# EAGLE design GE863FTDI_2.0 (EAGLE 5.07)
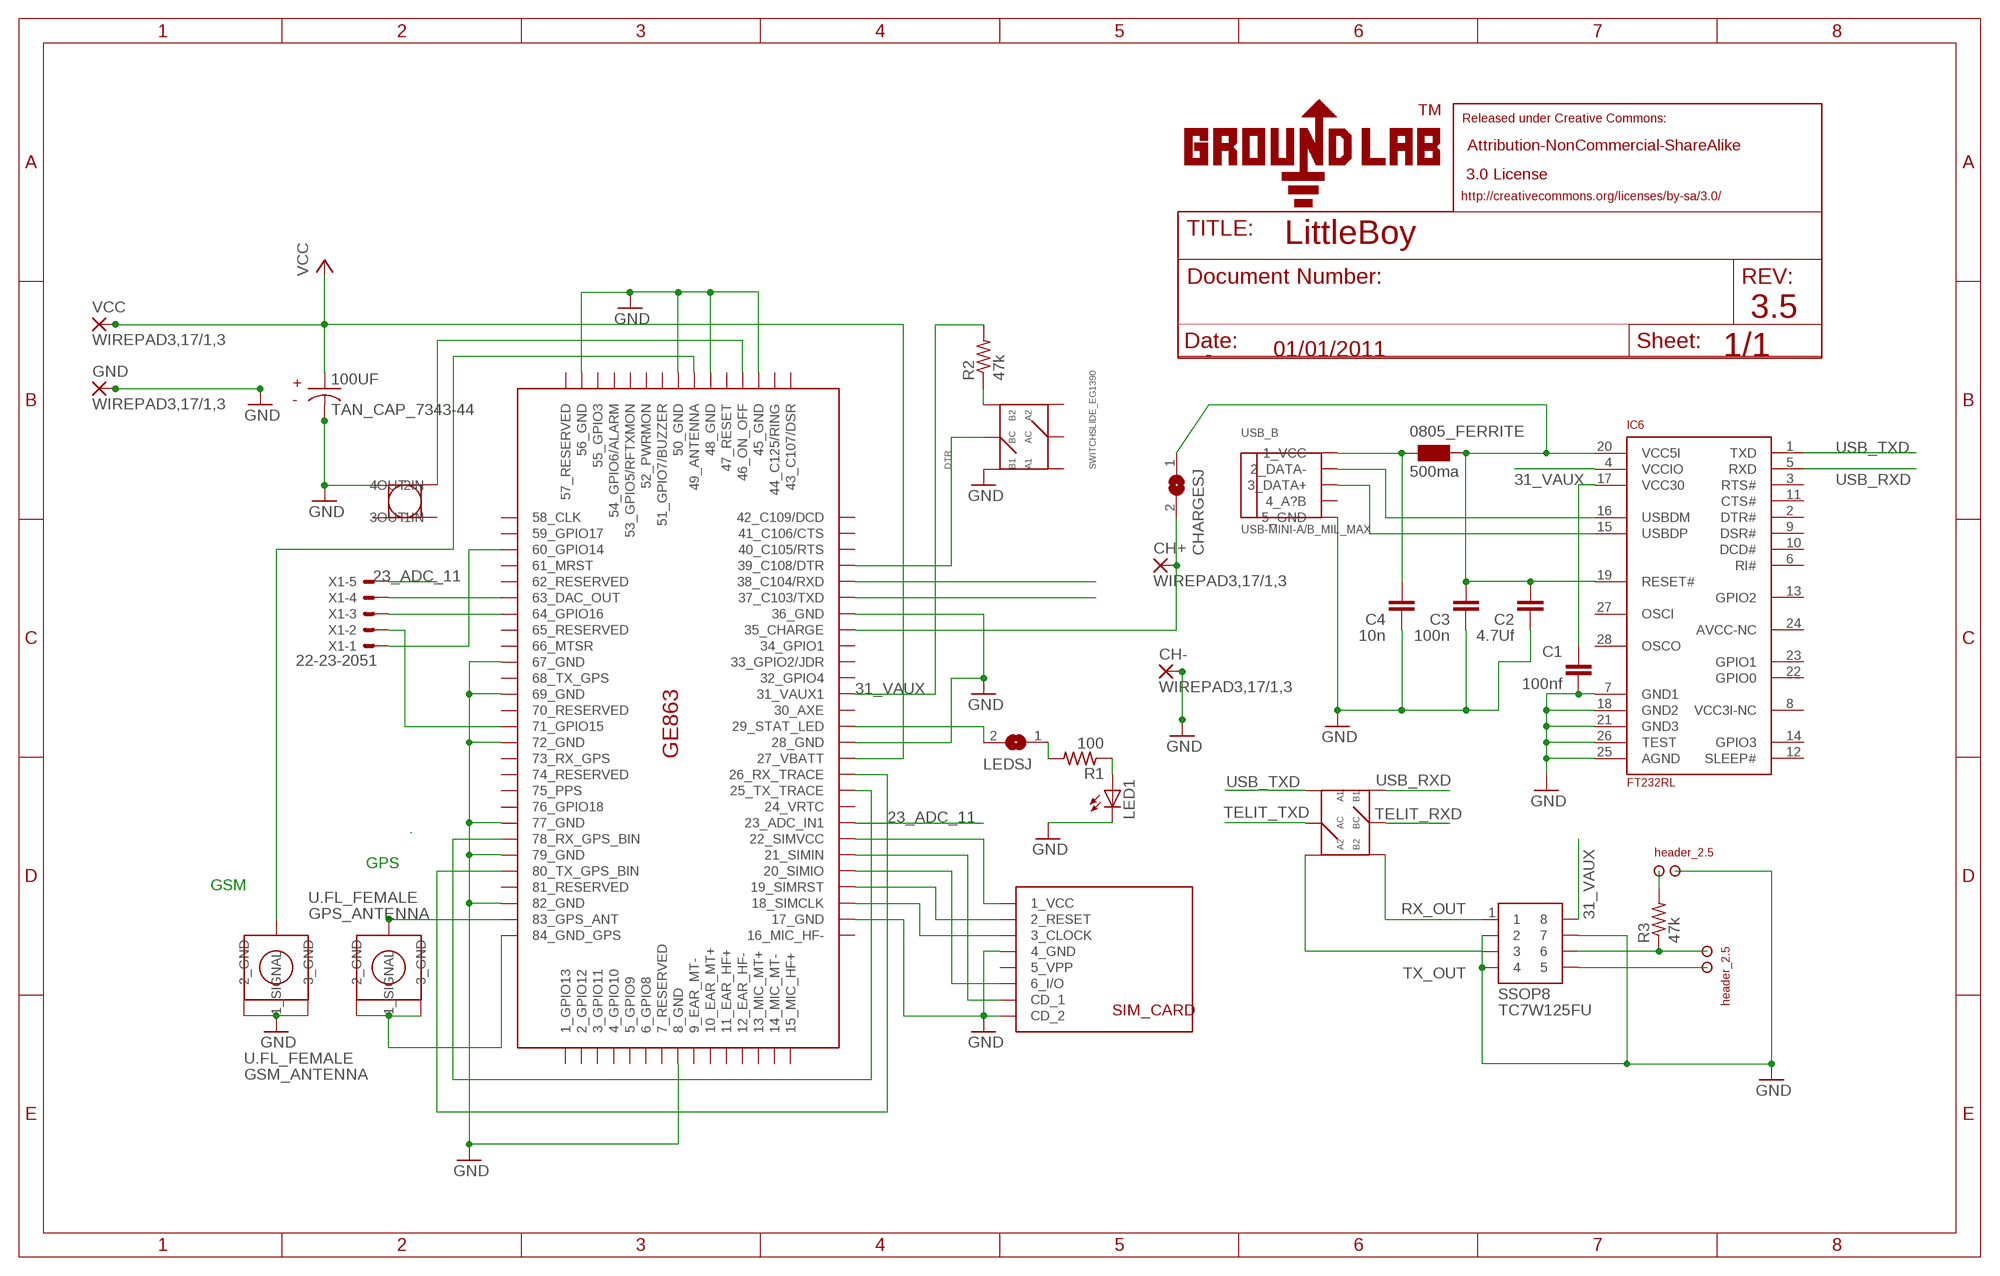
[diagram p0: schematic, sheet 1]

## Parts
100UF  TAN_CAP_7343-44  [TAN_CAP_7343-44]
0805_FERRITE  500ma  WE-CBF_0805  [0805]
C1  100nf  C-EU  [C0805RND]
C2  4.7Uf  C-EU  [C0805RND]
C3  100n  C-EU  [C0805RND]
C4  10n  C-EU  [C0805RND]
CH+  WIREPAD3,17/1,3  [3,17/1,3]
CH-  WIREPAD3,17/1,3  [3,17/1,3]
CHARGESJ  SJ  [SJ]
DTR  SWITCHSLIDE_EG1390  [SWITCHSLIDE_EG1390]
DTR1  SWITCHSLIDE_EG1390  [SWITCHSLIDE_EG1390]
GE863  GE836  [GE836]
GND  WIREPAD3,17/1,3  [3,17/1,3]
GPS_ANTENNA  U.FL_FEMALE  [U.FL_FEMALE]
GSM_ANTENNA  U.FL_FEMALE  [U.FL_FEMALE]
IC6  FT232RL  [SSOP28]
LED1  LEDCHIP-LED0805  [CHIP-LED0805]
LEDSJ  SJ  [SJ]
MICRO_POWER_GND  2.5_2HEADER  [2.5_2HEADER]
POWER  SWITCHPB_KPT-1187B  [SWITCHPB_KPT-1187B]
R1  100  R-US_R1206  [R1206]
R2  47k  R-US_R1206  [R1206]
R3  47k  R-US_R1206  [R1206]
RX/TX_ATMEL  2.5_2HEADER  [2.5_2HEADER]
TC7W125FU  SSOP8  [SSOP8]
U$7  SIMCARD_5036  [SIMCARD_5036]
USB_B  USB-MINI-A/B_MIL_MAX  [USB-MINI-A/B_MIL_MAX]
VCC  WIREPAD3,17/1,3  [3,17/1,3]
X1  22-23-2051  [22-23-2051]

## Nets
23_ADC_11: GE863.23_ADC_IN1 X1.5
31_VAUX: GE863.31_VAUX1 IC6.4(VCCIO) R2.2 TC7W125FU.8
60_GPIO14: GE863.60_GPIO14 X1.1
63_DAC_OUT: GE863.63_DAC_OUT X1.4
64_GPIO16: GE863.64_GPIO16 X1.3
71_GPIO15: GE863.71_GPIO15 X1.2
BAT+: CH+.1(P) CHARGESJ.2 GE863.35_CHARGE
DTR: DTR.BCOM GE863.39_C108/DTR
GND: 100UF.NEG C1.1 C2.1 C3.2 C4.2 CH-.1(P) DTR.B1 GE863.8_GND GE863.17_GND GE863.28_GND GE863.36_GND GE863.45_GND GE863.48_GND GE863.50_GND GE863.56_GND GE863.67_GND GE863.69_GND GE863.72_GND GE863.77_GND GE863.79_GND GE863.82_GND GND.1(P) GSM_ANTENNA.GND1(2_GND) GSM_ANTENNA.GND2(3_GND) IC6.7(GND1) IC6.18(GND2) IC6.21(GND3) IC6.25(AGND) IC6.26(TEST) LED1.C MICRO_POWER_GND.P$2(H2) POWER.2IN TC7W125FU.2 TC7W125FU.4 TC7W125FU.7 U$7.4_GND U$7.CD_2 USB_B.5_GND
MICRO_VCC: MICRO_POWER_GND.P$1(H1) R3.2
N$2: GE863.49_ANTENNA GSM_ANTENNA.SIGNAL(1_SIGNAL)
N$4: DTR.B2 R2.1
N$6: LEDSJ.1 R1.2
N$7: GE863.26_RX_TRACE GE863.80_TX_GPS_BIN
N$8: GE863.25_TX_TRACE GE863.78_RX_GPS_BIN
N$10: 0805_FERRITE.1 C4.1 USB_B.1_VCC
N$11: GE863.84_GND_GPS GPS_ANTENNA.GND1(2_GND) GPS_ANTENNA.GND2(3_GND)
N$13: 0805_FERRITE.2 C2.2 C3.1 CHARGESJ.1 IC6.19(RESET#) IC6.20(VCC5I)
N$14: LED1.A R1.1
N$15: IC6.16(USBDM) USB_B.2_DATA-
N$16: IC6.15(USBDP) USB_B.3_DATA+
N$18: GE863.29_STAT_LED LEDSJ.2
N$22: C1.2 IC6.17(VCC30)
N$23: GE863.83_GPS_ANT GPS_ANTENNA.SIGNAL(1_SIGNAL)
ON/OFF: GE863.46_ON_OFF POWER.4OUT
RX_MICRO: R3.1 RX/TX_ATMEL.P$1(H1) TC7W125FU.6
RX_OUT: DTR1.B2 TC7W125FU.1
SIMCLK: GE863.18_SIMCLK U$7.3_CLOCK
SIMIN: GE863.21_SIMIN U$7.CD_1
SIMOUT: GE863.20_SIMIO U$7.6_I/O
SIMRST: GE863.19_SIMRST U$7.2_RESET
SIMVCC: GE863.22_SIMVCC U$7.1_VCC
TELIT_RXD: DTR1.BCOM GE863.38_C104/RXD
TELIT_TXD: DTR1.ACOM GE863.37_C103/TXD
TX_MICRO: RX/TX_ATMEL.P$2(H2) TC7W125FU.5
TX_OUT: DTR1.A2 TC7W125FU.3
USB_RXD: DTR1.B1 IC6.5(RXD)
USB_TXD: DTR1.A1 IC6.1(TXD)
VCC: 100UF.POS GE863.27_VBATT VCC.1(P)
Unconnected: DTR.A1 DTR.A2 DTR.ACOM GE863.1_GPIO13 GE863.2_GPIO12 GE863.3_GPIO11 GE863.4_GPIO10 GE863.5_GPIO9 GE863.6_GPIO8 GE863.7_RESERVED GE863.9_EAR_MT- GE863.10_EAR_MT+ GE863.11_EAR_HF+ GE863.12_EAR_HF- GE863.13_MIC_MT+ GE863.14_MIC_MT- GE863.15_MIC_HF+ GE863.16_MIC_HF- GE863.24_VRTC GE863.30_AXE GE863.32_GPIO4 GE863.33_GPIO2/JDR GE863.34_GPIO1 GE863.40_C105/RTS GE863.41_C106/CTS GE863.42_C109/DCD GE863.43_C107/DSR GE863.44_C125/RING GE863.47_RESET GE863.51_GPIO7/BUZZER GE863.52_PWRMON GE863.53_GPIO5/RFTXMON GE863.54_GPIO6/ALARM GE863.55_GPIO3 GE863.57_RESERVED GE863.58_CLK GE863.59_GPIO17 GE863.61_MRST GE863.62_RESERVED GE863.65_RESERVED GE863.66_MTSR GE863.68_TX_GPS GE863.70_RESERVED GE863.73_RX_GPS GE863.74_RESERVED GE863.75_PPS GE863.76_GPIO18 GE863.81_RESERVED IC6.2(DTR#) IC6.3(RTS#) IC6.6(RI#) IC6.8(VCC3I-NC) IC6.9(DSR#) IC6.10(DCD#) IC6.11(CTS#) IC6.12(SLEEP#) IC6.13(GPIO2) IC6.14(GPIO3) IC6.22(GPIO0) IC6.23(GPIO1) IC6.24(AVCC-NC) IC6.27(OSCI) IC6.28(OSCO) POWER.1IN POWER.3OUT U$7.5_VPP USB_B.4_A?B

## Notes on the sheet
- LittleBoy
- 3.5
- 01/01/2011 | 1/1
- GPS
- GSM

## Library data of the parts
100UF = myLib:TAN_CAP_7343-44
0805_FERRITE = wuerth-elektronik:WE-CBF: SMD EMI Suppression Ferrite Beads - excellent anti-EMI properties - low DCR - impedances till 3000 ohms - rated current up to 6 A
C1-C4 = rcl:C-EU: CAPACITOR, European symbol
CH+ CH- GND VCC = wirepad:WIREPAD: Wire PAD connect wire on PCB
CHARGESJ LEDSJ = jumper:SJ: SMD solder JUMPER
DTR DTR1 = myLib:SWITCHSLIDE_EG1390
GE863 = myLib:GE836
GPS_ANTENNA GSM_ANTENNA = myLib:U.FL_FEMALE: tyco electronics 1566230 UMCC Female
IC6 = SmartPrj:FT232RL
LED1 = led:LED: LED OSRAM: - CHIPLED LG R971, LG N971, LY N971, LG Q971, LY Q971, LO R971, LY R971 LH N974, LH R974 LS Q976, LO Q976, LY Q976 LO Q996 - Hyper CHIPLED LW Q18S LB Q993, LB Q99A, LB R99A - SideLED LS A670, LO A670, LY A670, LG A670, LP A670 LB A673, LV A673, LT A673, LW A673 LH A674 LY A675 LS A676, LA A676, LO A676, LY A676, LW A676 LS A679, LY A679, LG A679 - Hyper Micro SIDELED® LS Y876, LA Y876, LO Y876, LY Y876 LT Y87S - SmartLED LW L88C, LW L88S LB L89C, LB L89S, LG L890 LS L89K, LO L89K, LY L89K LS L896, LA L896, LO L896, LY L896 - TOPLED LS T670, LO T670, LY T670, LG T670, LP T670 LSG T670, LSP T670, LSY T670, LOP T670, LYG T670 LG T671, LOG T671, LSG T671 LB T673, LV T673, LT T673, LW T673 LH T674 LS T676, LA T676, LO T676, LY T676, LB T676, LH T676, LSB T676, LW T676 LB T67C, LV T67C, LT T67C, LS T67K, LO T67K, LY T67K, LW E67C LS E67B, LA E67B, LO E67B, LY E67B, LB E67C, LV E67C, LT E67C LW T67C LS T679, LY T679, LG T679 LS T770, LO T770, LY T770, LG T770, LP T770 LB T773, LV T773, LT T773, LW T773 LH T774 LS E675, LA E675, LY E675, LS T675 LS T776, LA T776, LO T776, LY T776, LB T776 LHGB T686 LT T68C, LB T68C - Hyper Mini TOPLED® LB M676 - Mini TOPLED Santana® LG M470 LS M47K, LO M47K, LY M47K Source: http://www.osram.convergy.de/
MICRO_POWER_GND RX/TX_ATMEL = myHeaders:2.5_2HEADER
POWER = myLib:SWITCHPB_KPT-1187B
R1-R3 = rcl:R-US_: RESISTOR, American symbol
TC7W125FU = myIC:SSOP8: ssop8 package
U$7 = myLib:SIMCARD_5036
USB_B = myConnectors:USB-MINI-A/B_MIL_MAX: part# 897-43-005-00-100001
X1 = con-molex:22-23-2051: .100" (2.54mm) Center Header - 5 Pin

## Net classes
0 default: width 0.203 mm, drill 0.406 mm, clearance 0.203 mm
1 power: width 0.61 mm, drill 0.711 mm, clearance 0.254 mm
2 gnd: width 0.305 mm, drill 0.711 mm, clearance 0.254 mm
3 vcc: width 0.508 mm, drill 0.711 mm, clearance 0.254 mm

## Board
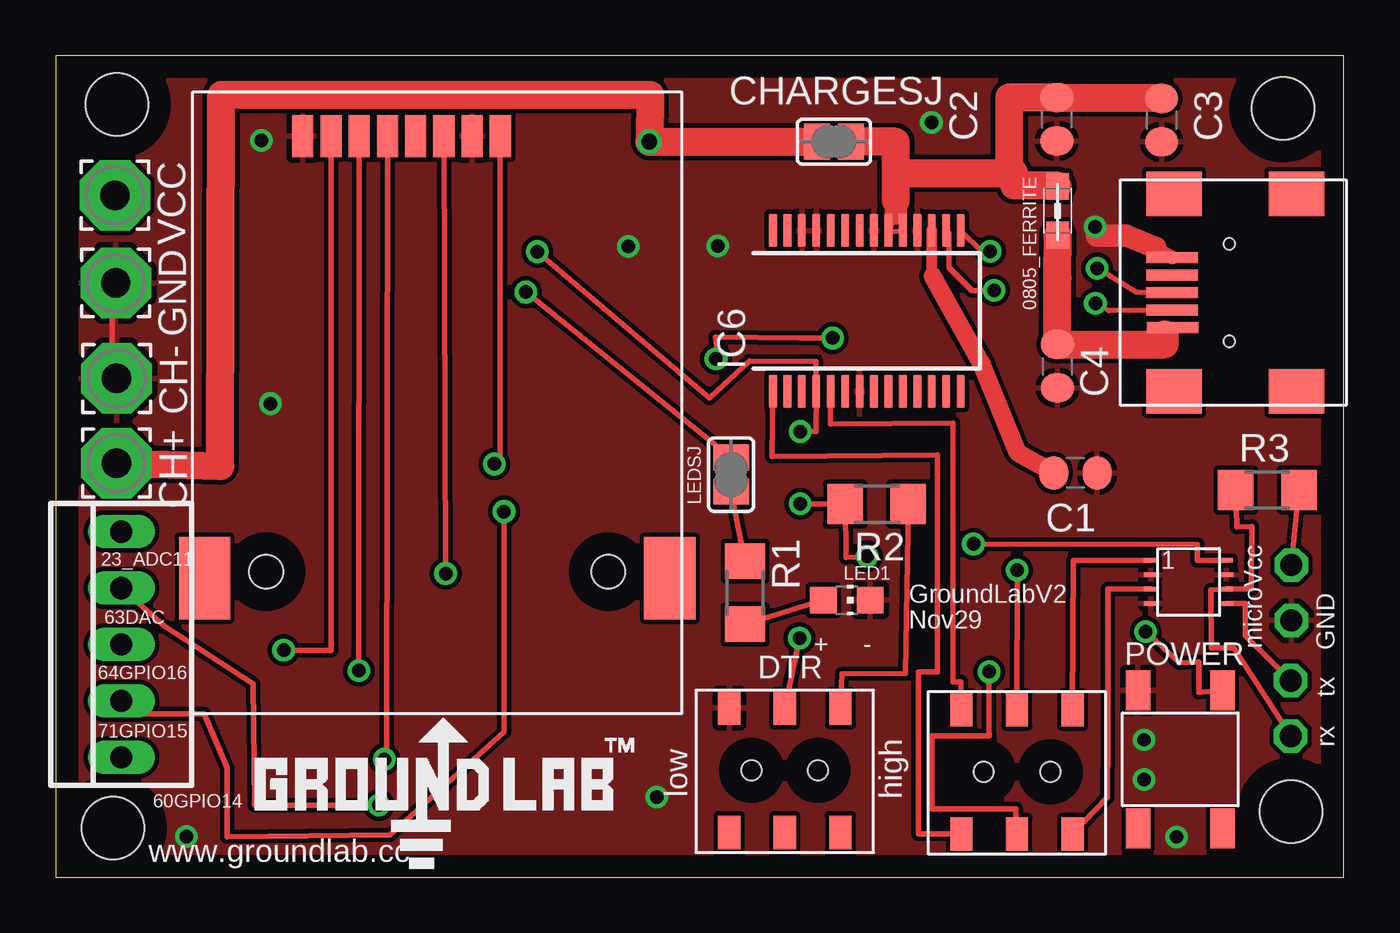
[diagram p1: board, top side]
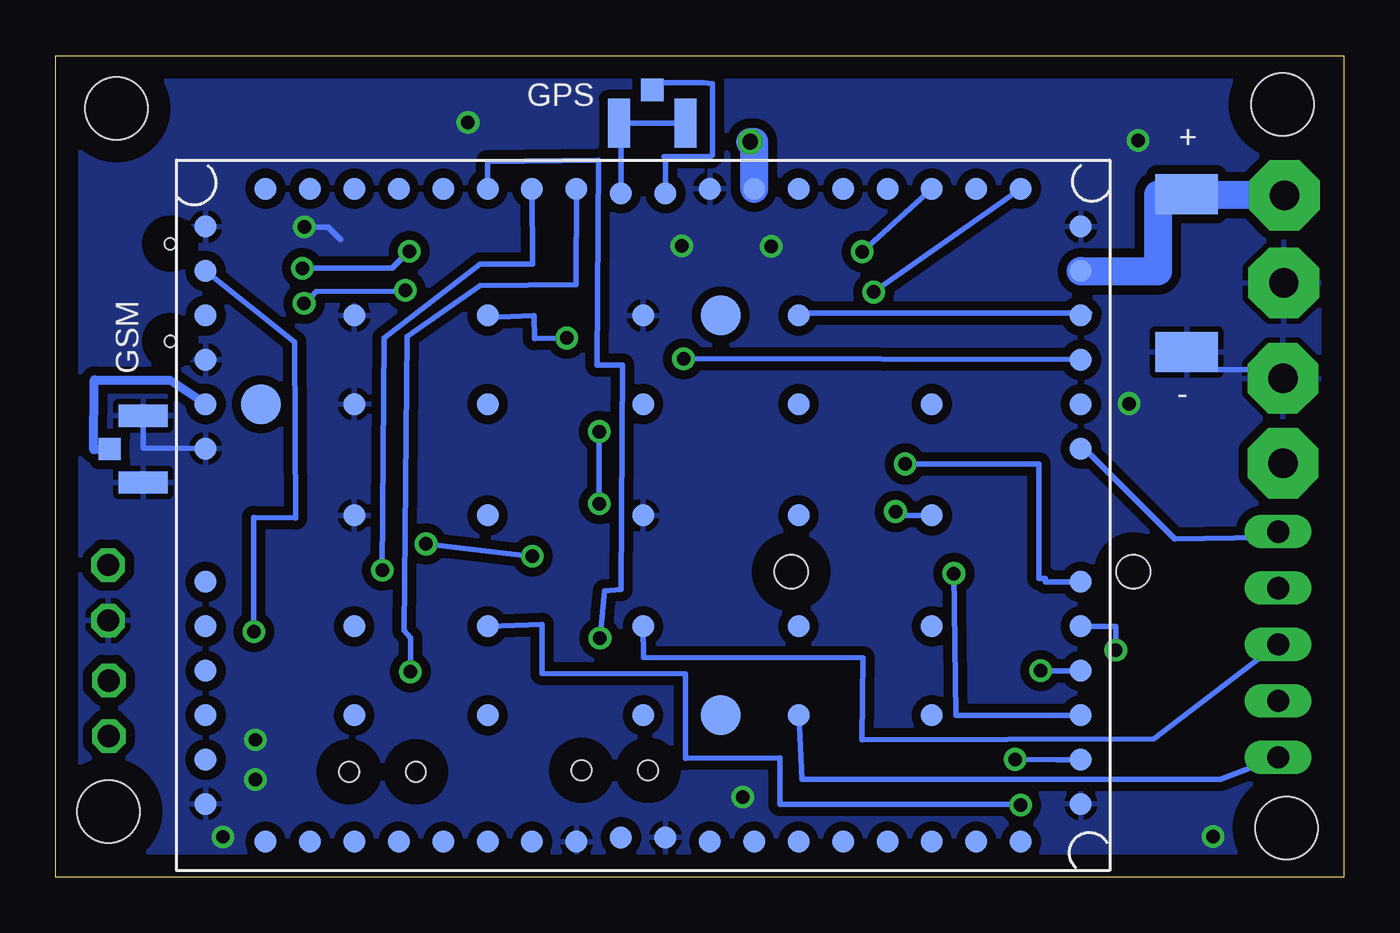
[diagram p2: board, bottom side, seen from below]

Size 58 x 37 mm. Coordinates in mm from the lower left corner, seen from the top.
Outline: 0,0 58,0 58,37 0,37 0,0
Copper layers (1*16): Top 0.035mm / dielectric 1.5mm / Bottom 0.035mm
Design rules "default *": minimum track width 10mil, minimum drill 24mil, track to track 8mil, track to pad 8mil, pad to pad 8mil, via to via 8mil, smd to smd 8mil, copper to edge 40mil, drill to drill 8mil, minimum pad ring 10mil, minimum via ring 8mil, stop-mask expansion 4mil, vias tented up to drill 26mil, thermal gap 10mil
Holes 2.8 mm at 55.25,34.61 55.62,2.96 2.59,2.22 2.77,34.79

### Footprints (pad centres in the part's own frame; a part is rotated, then mirrored left to right if it is on the bottom)
TAN_CAP_7343-44 = smd 2.8 x 1.8: NEG 0,-3.5; POS 0,3.6
0805 = smd 1.2 x 1: 1 -1.1,0; 2 1.1,0
C0805RND = smd 1.3 x 1.5: 1 -0.977,0; 2 0.977,0
3,17/1,3 = drill 1.321 pad 3.175 octagon: 1 0,0
SJ = smd 1.168 x 1.6: 1 -0.762,0; 2 0.762,0
SWITCHSLIDE_EG1390 = smd 1 x 1.5: A1 -2.5,-5.6; A2 2.5,-5.6; ACOM 0,-5.6; B1 -2.5,0; B2 2.5,0; BCOM 0,0 | hole 0.889: -1.5,-2.8; 1.5,-2.8
GE836 = smd 1 x 1: 1_GPIO13 -14.7,17; 2_GPIO12 -14.7,15; 3_GPIO11 -14.7,13; 4_GPIO10 -14.7,11; 5_GPIO9 -14.7,9; 6_GPIO8 -14.7,7; 7_RESERVED -14.7,5; 8_GND -14.7,3; 9_EAR_MT- -14.7,-3; 10_EAR_MT+ -14.7,-5; 11_EAR_HF+ -14.7,-7; 12_EAR_HF- -14.7,-9; 13_MIC_MT+ -14.7,-11; 14_MIC_MT- -14.7,-13; 15_MIC_HF+ -14.7,-15; 16_MIC_HF- -14.7,-17; 17_GND -13,-19.7; 18_SIMCLK -11,-19.7; 19_SIMRST -9,-19.7; 20_SIMIO -7,-19.7; 21_SIMIN -5,-19.7; 22_SIMVCC -3,-19.7; 23_ADC_IN1 3,-19.7; 24_VRTC 5,-19.7; 25_TX_TRACE 7,-19.7; 26_RX_TRACE 9,-19.7; 27_VBATT 11,-19.7; 28_GND 13,-19.7; 29_STAT_LED 14.7,-17; 30_AXE 14.7,-15; 31_VAUX1 14.7,-13; 32_GPIO4 14.7,-11; 33_GPIO2/JDR 14.7,-9; 34_GPIO1 14.7,-7; 35_CHARGE 14.7,-5; 36_GND 14.7,-3; 37_C103/TXD 14.7,3; 38_C104/RXD 14.7,5; 39_C108/DTR 14.7,7; 40_C105/RTS 14.7,9; 41_C106/CTS 14.7,11; 42_C109/DCD 14.7,13; 43_C107/DSR 14.7,15; 44_C125/RING 14.7,17; 45_GND 13,19.7; 46_ON_OFF 11,19.7; 47_RESET 9,19.7; 48_GND 7,19.7; 49_ANTENNA 5,19.7; 50_GND 3,19.7; 51_GPIO7/BUZZER -3,19.7; 52_PWRMON -5,19.7; 53_GPIO5/RFTXMON -7,19.7; 54_GPIO6/ALARM -9,19.7; 55_GPIO3 -11,19.7; 56_GND -13,19.7; 57_RESERVED -9,13; 58_CLK -9,7; 59_GPIO17 -9,0; 60_GPIO14 -9,-7; 61_MRST -9,-13; 62_RESERVED -5,13; 63_DAC_OUT -5,7; 64_GPIO16 -5,0; 65_RESERVED -5,-7; 66_MTSR -5,-13; 67_GND 0,13; 68_TX_GPS 0,7; 69_GND 0,0; 70_RESERVED 0,-7; 71_GPIO15 0,-13; 72_GND 5,13; 73_RX_GPS 5,7; 74_RESERVED 5,0; 75_PPS 5,-7; 76_GPIO18 5,-13; 77_GND 9,13; 78_RX_GPS_BIN 9,7; 79_GND 9,0; 80_TX_GPS_BIN 9,-7; 81_RESERVED -14.5,1; 82_GND -14.5,-1; 83_GPS_ANT 14.5,-1; 84_GND_GPS 14.5,1 | smd 1.8 x 1.8: P$85 5,17.2; P$86 9,-3.5; P$87 -9,-3.5
U.FL_FEMALE = smd 1 x 2.2: GND1 -1.5,0; GND2 1.5,0 | smd 1 x 1: SIGNAL 0,1.5
SSOP28 = smd 0.381 x 1.499: 1 -4.225,-3.625; 2 -3.575,-3.625; 3 -2.925,-3.625; 4 -2.275,-3.625; 5 -1.625,-3.625; 6 -0.975,-3.625; 7 -0.325,-3.625; 8 0.325,-3.625; 9 0.975,-3.625; 10 1.625,-3.625; 11 2.275,-3.625; 12 2.925,-3.625; 13 3.575,-3.625; 14 4.225,-3.625; 15 4.225,3.625; 16 3.575,3.625; 17 2.925,3.625; 18 2.275,3.625; 19 1.625,3.625; 20 0.975,3.625; 21 0.325,3.625; 22 -0.325,3.625; 23 -0.975,3.625; 24 -1.625,3.625; 25 -2.275,3.625; 26 -2.925,3.625; 27 -3.575,3.625; 28 -4.225,3.625
CHIP-LED0805 = smd 1.2 x 1.2: A 0,-1.05; C 0,1.05
2.5_2HEADER = drill 1 octagon: P$1 -2.48,0; P$2 0.02,0
SWITCHPB_KPT-1187B = smd 1.8 x 1.1: 1IN -3.1,1.9; 2IN 3.1,1.9; 3OUT -3.1,-1.9; 4OUT 3.1,-1.9
R1206 = smd 1.6 x 1.803: 1 -1.422,0; 2 1.422,0
SSOP8 = smd 0.6 x 0.2: 1 -1.7,0.975; 2 -1.7,0.325; 3 -1.7,-0.325; 4 -1.7,-0.975; 5 1.7,-0.975; 6 1.7,-0.325; 7 1.71,0.325; 8 1.7,0.975
SIMCARD_5036 = smd 1.9 x 0.95: 1_VCC 0,2.84; 2_RESET 0,0.3; 3_CLOCK 0,-2.24; 4_GND 0,1.57; 5_VPP 0,-0.97; 6_I/O 0,-3.51; CD_1 0,-4.78; CD_2 0,-6.05 | smd 3.7 x 2.3: P$9 19.9,-10.47; P$10 19.9,10.47 | hole 1.5: 19.6,-7.7; 19.6,7.7
USB-MINI-A/B_MIL_MAX = smd 2.311 x 0.483: 1_VCC 7.823,1.575; 2_DATA- 7.836,0.787; 3_DATA+ 7.836,0; 4_A?B 7.836,-0.787; 5_GND 7.836,-1.575 | smd 2.489 x 2.007: GROUND1 7.747,4.445; GROUND2 2.235,-4.445; GROUND3 2.235,4.445; GROUND4 7.747,-4.445 | hole 0.5: 5.258,2.197; 5.258,-2.197
22-23-2051 = drill 1 long: 1 -5.08,0; 2 -2.54,0; 3 0,0; 4 2.54,0; 5 5.08,0

### Placement (x,y rotation side)
100UF  7.08,27.15 0 bottom
0805_FERRITE  45.11,30.01 90 top
C1  45.91,18.21 180 top
C2  45.07,34.13 90 top
C3  49.79,34.09 270 top
C4  45.1,23.01 270 top
CH+  2.74,18.65 270 top
CH-  2.75,22.46 270 top
CHARGESJ  35.04,33.12 180 top
DTR  32.83,7.62 0 top
DTR1  43.28,7.55 0 top
GE863  31.55,16.3 90 bottom
GND  2.71,26.76 270 top
GPS_ANTENNA  31.14,33.95 0 bottom
GSM_ANTENNA  54.06,19.28 90 bottom
IC6  36.52,25.5 0 top
LED1  35.62,12.48 270 top
LEDSJ  30.41,18.13 90 top
MICRO_POWER_GND  55.63,11.58 270 top
POWER  50.63,5.31 90 top
R1  31.04,12.81 90 top
R2  36.97,16.8 180 top
R3  54.55,17.44 0 top
RX/TX_ATMEL  55.6,8.84 90 top
TC7W125FU  51,13.3 0 top
U$3  [GROUNDLAB_TM_1]  8.82,0.16 0 top
U$7  17.18,33.37 270 top
USB_B  58.1,26.33 180 top
VCC  2.67,30.71 270 top
X1  2.96,10.48 90 top

### Tracks (layer width: path | path; a pad name or v marks a point on that pad's centre or on a via)
23_ADC_11
  Bottom 0.254: GE863.23_ADC_IN1 11.43,19.05 7.62,15.24 3.56,15.31 X1.5
31_VAUX  (via drill 0.61)
  Top 0.254: TC7W125FU.8 51.39,14.26 51.4,14.99 v41.32,15.01 | v36.54,14.45 35.58,14.41 R2.2 v33.53,16.82 | v33.53,20.07 34.24,20.07 IC6.4 34.24,23.21 31.23,23.24 29.44,21.59 v21.68,28.17
  Bottom 0.254: v36.54,14.45 v41.32,15.01 | v33.53,20.07 v33.53,16.82 | GE863.31_VAUX1 v21.68,28.17
60_GPIO14
  Bottom 0.254: GE863.60_GPIO14 24.39,4.41 5.57,4.42 X1.1
63_DAC_OUT  (via drill 0.61)
  Top 0.254: v14.56,3.25 8.97,3.25 8.9,8.7 4.89,11.32 X1.4
  Bottom 0.254: GE863.63_DAC_OUT 36.1,11.39 36.1,9.18 29.65,9.15 29.65,5.35 25.38,5.37 25.38,3.28 14.56,3.28 v14.56,3.25
64_GPIO16
  Bottom 0.254: X1.3 3.79,9.87 8.55,6.24 21.71,6.19 21.66,9.88 31.54,9.9 GE863.64_GPIO16
71_GPIO15  (via drill 0.61)
  Top 0.254: v20.19,16.47 20.19,6.54 15.05,1.91 7.73,1.83 | 7.73,1.83 7.72,2.88 | 7.73,1.83 7.72,4.93 6.69,7.36 3.21,7.35 X1.2
  Bottom 0.254: GE863.71_GPIO15 20.02,16.3 v20.19,16.47
BAT+  (via drill 0.71)
  Top 1.27: CH+.1 7.42,18.51 7.46,35.23 26.77,35.23 v26.73,33.12 CHARGESJ.2
  Bottom 1.27: v26.73,33.12 26.55,33.12 GE863.35_CHARGE
DTR  (via drill 0.61)
  Top 0.254: DTR.BCOM v33.49,10.76
  Bottom 0.254: GE863.39_C108/DTR 38.56,32.23 33.56,32.29 33.63,23.07 32.48,23.07 32.55,12.97 33.29,12.9 v33.49,10.76
GND  (via drill 0.6, 0.61)
  Top 0.254: GND.1 2.54,26.67 2.54,22.86 CH-.1 | v46.8,29.28 46.88,28.9
  Top 0.61: 49.5,28.36 USB_B.5_GND
  Top 1.016: 49.5,28.36 48.21,28.9 46.88,28.9
  Bottom 0.254: 100UF.NEG 6.35,22.86 2.54,22.86 CH-.1 | GE863.50_GND 54.06,19.34 GSM_ANTENNA.GND2 | v46.8,29.28 45.73,29.28 45.17,28.72
  other vias: 27.07,3.62 5.89,1.83 25.79,28.41 29.81,28.43 39.43,33.99 49.01,6.19 49.01,4.4 50.46,1.82 9.27,33.18 9.68,21.33
  pour Top: 0,0 0,-0.07 0.07,-0.07
  pour Bottom (isolate 0.406): 0.2,36.83 57.82,36.86 57.85,35.58 57.85,0.19 0.19,0.15 0.19,2.73 0.17,2.77 0.28,36.42
  pour Top: 0.53,36.81 57.8,36.82 57.84,0.17 0.24,0.16 0.17,1.02 0.2,1.94 0.2,36.82
MICRO_VCC
  Top 0.254: MICRO_POWER_GND.P$1 R3.2
N$2
  Bottom 0.406: GE863.49_ANTENNA 52.85,22.38 56.25,22.4 56.28,19.25 GSM_ANTENNA.SIGNAL
N$4
  Top 0.254: DTR.B2 35.39,9.15 38.26,9.19 R2.1
N$6
  Top 0.254: R1.2 LEDSJ.1
N$7
  Bottom 0.254: GE863.26_RX_TRACE 11.43,25.4 24.13,25.4 GE863.80_TX_GPS_BIN
N$8  (via drill 0.61)
  Top 0.254: v34.98,24.28 33.54,24.27 29.71,24.32 29.76,23.96 v29.73,23.35
  Bottom 0.254: GE863.78_RX_GPS_BIN 38.58,25.2 36.47,25.29 36.43,24.25 v34.98,24.28 | v29.73,23.35 GE863.25_TX_TRACE
N$10
  Top 0.254: 49.93,24.44 50.12,23.93 USB_B.1_VCC
  Top 1.27: 0805_FERRITE.1 45.1,27 C4.1 49.93,23.99 49.93,24.44
N$11
  Bottom 0.254: GE863.84_GND_GPS 32.55,34.19 GPS_ANTENNA.GND1 GPS_ANTENNA.GND2
N$13
  Top 0.254: 37.46,29.04 38.13,30.48 37.83,30.48 | 37.46,29.04 IC6.19 | 37.46,29.04 37.58,30.06 IC6.20
  Top 1.016: 37.83,30.48 37.83,29.87
  Top 1.27: CHARGESJ.1 37.83,33.12 37.83,31.71 | 37.83,30.48 37.83,31.71 | 37.83,31.71 42.93,31.71 | 0805_FERRITE.2 45.07,31.16 43.15,31.16 43.15,31.71 42.93,31.71 | 42.93,31.71 42.93,35.12 C2.2 49.79,35.11 C3.1
N$14
  Top 0.254: R1.1 LED1.A
N$15  (via drill 0.61)
  Top 0.254: USB_B.2_DATA- 47.41,25.52 v46.81,25.84 | v42.26,26.42 41.24,26.42 40.21,27.45 40.21,29.01 IC6.16
  Bottom 0.254: v46.81,25.84 46.7,25.9 46.26,26.38 42.29,26.39 v42.26,26.42
N$16  (via drill 0.61)
  Top 0.254: USB_B.3_DATA+ 48.66,26.34 v46.89,27.42 | v42.08,28.19 41.68,28.19 IC6.15
  Bottom 0.254: v46.89,27.42 42.85,27.42 v42.08,28.19
N$18  (via drill 0.61)
  Top 0.254: v21.17,26.35 LEDSJ.2
  Bottom 0.254: GE863.29_STAT_LED v21.17,26.35
N$22
  Top 0.5: 39.45,27.09 IC6.17
  Top 0.61: 39.48,27.09 39.45,27.09
  Top 0.813: 39.48,27.09 41.71,23.09 43.33,19.11 C1.2
N$23
  Bottom 0.254: GE863.83_GPS_ANT 30.55,32.39 30.6,32.44 28.51,32.44 28.43,32.52 28.43,35.74 28.84,35.77 31.11,35.77 GPS_ANTENNA.SIGNAL
ON/OFF  (via drill 0.61)
  Top 0.254: POWER.4OUT 51.46,8.32 51.46,9.7 50.59,9.66 v49.07,11.06
  Bottom 0.254: GE863.46_ON_OFF 47.24,24.11 47.2,16.18 49.09,16.21 v49.07,11.06
RX_MICRO
  Top 0.254: RX/TX_ATMEL.P$1 53.05,10.33 52.03,10.34 52,12.94 TC7W125FU.6 53.82,12.99 53.85,15.79 53.18,15.78 R3.1
RX_OUT
  Top 0.254: TC7W125FU.1 45.81,14.26 DTR1.B2
SIMCLK  (via drill 0.61)
  Top 0.254: v14.81,5.31 14.91,5.33 U$7.3_CLOCK
  Bottom 0.254: GE863.18_SIMCLK 12.92,5.29 v14.81,5.31
SIMIN  (via drill 0.61)
  Top 0.254: v10.27,10.22 12.4,10.21 12.41,10.59 12.4,10.66 U$7.CD_1
  Bottom 0.254: GE863.21_SIMIN 10.28,11.3 v10.27,10.22
SIMOUT  (via drill 0.61)
  Top 0.254: v13.66,9.3 13.65,9.28 U$7.6_I/O
  Bottom 0.254: GE863.20_SIMIO v13.66,9.3 13.64,9.32
SIMRST  (via drill 0.61)
  Top 0.254: v17.56,13.68 U$7.2_RESET
  Bottom 0.254: GE863.19_SIMRST 17.47,7.29 v17.56,13.68
SIMVCC  (via drill 0.61)
  Top 0.254: v19.75,18.61 20.02,18.61 U$7.1_VCC
  Bottom 0.254: GE863.22_SIMVCC 13.44,13.3 13.44,13.46 13.73,13.46 13.73,18.61 v19.75,18.61
TELIT_RXD  (via drill 0.61)
  Top 0.254: DTR1.BCOM v43.29,13.82
  Bottom 0.254: v43.29,13.82 43.22,24.29 38.9,27.6 36.53,27.6 GE863.38_C104/RXD
TELIT_TXD  (via drill 0.61)
  Top 0.254: v42.02,9.25 42.02,6.62 42.04,6.37 39.45,6.37 39.45,3.09 43.24,3.09 43.24,1.95 DTR1.ACOM
  Bottom 0.254: v42.02,9.25 42.01,10.77 42.32,11.12 42.18,24.34 38.9,26.65 34.57,26.69 GE863.37_C103/TXD
TX_MICRO
  Top 0.254: RX/TX_ATMEL.P$2 53.56,10.87 53.55,12.33 TC7W125FU.5
TX_OUT
  Top 0.254: TC7W125FU.3 47.37,12.98 47.37,6.25 47.35,3.59 DTR1.A2
USB_RXD
  Top 0.254: IC6.5 34.88,20.4 40.39,20.45 40.39,8.8 40.75,8.8 40.75,7.55 DTR1.B1
USB_TXD
  Top 0.254: DTR1.A1 38.85,1.95 38.85,9.26 39.69,9.26 39.7,19.02 32.25,18.95 IC6.1
VCC
  Bottom 1.27: VCC.1 7.08,30.71 100UF.POS 8.37,30.75 8.37,27.28 11.85,27.28 GE863.27_VBATT

### Text on the board
tPlace: www.groundlab.cc
tNames: 23_ADC11 | GroundLabV2 | 63DAC | Nov29 | + | - | POWER | microVcc | GND | 64GPIO16 | DTR | tx | 71GPIO15 | rx | low | high | 60GPIO14
bNames: GPS | + | GSM | -